# Altium project SL1 Xilinx Spartan-IIE PQ208 Rev1.01.PrjPcb
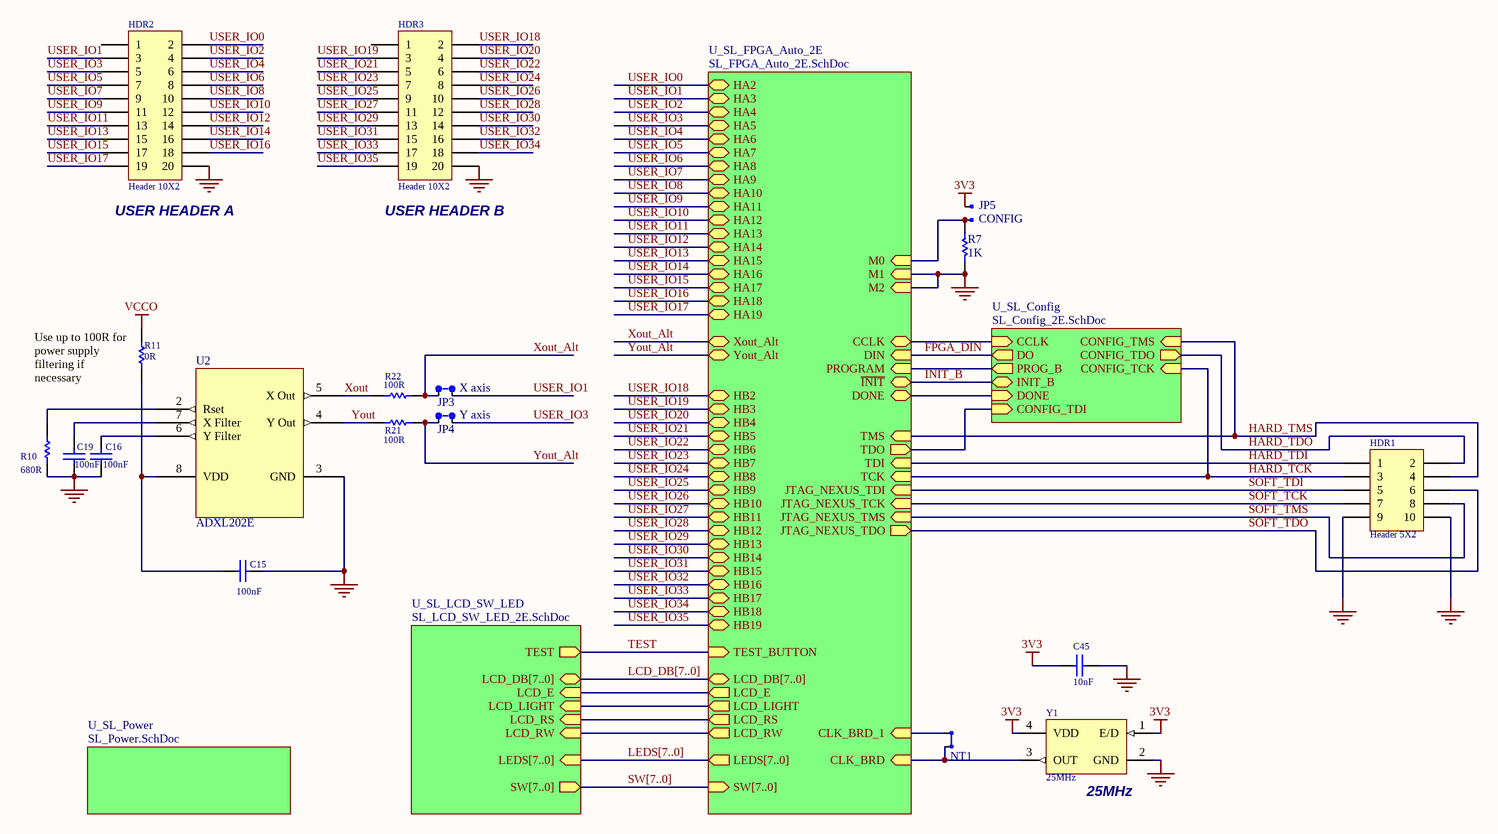
[diagram p0: SL1 Xilinx Spartan-IIE PQ208 Rev1.01.SchDoc]
5 sheets, 117 parts. Net scope: hierarchical (ports join the sheet entries above them; power ports are global).
Board file: SL1 Xilinx Spartan-IIE PQ208 Rev1.01.PcbDoc
Sheets:
  SL1 Xilinx Spartan-IIE PQ208 Rev1.01.SchDoc
    U_SL_Config = SL_Config_2E.SchDoc
    U_SL_LCD_SW_LED = SL_LCD_SW_LED_2E.SchDoc
    U_SL_FPGA_Auto_2E = SL_FPGA_Auto_2E.SchDoc
    U_SL_Power = SL_Power.SchDoc

## Sheet SL1 Xilinx Spartan-IIE PQ208 Rev1.01.SchDoc: Spirit Level - Spartan 2E
size B; Organization: Altium Limited; Address1: L3, 12a Rodborough Rd; Address2: Frenchs Forest; Address3: NSW; Address4: Australia 2086; DocumentNumber: 5; SheetNumber: 5; SheetTotal: 5; Library Name: SpiritLevel_2E.SchLib

### Parts
C15  100nF  [CC1608-0603]
C16  100nF  [CC1608-0603]
C19  100nF  [CC1608-0603]
C45  10nF  [CC1608-0603]
HDR1  Header 5X2  [HDR2X5_LP]
HDR2  Header 10X2  [HDR2X10]
HDR3  Header 10X2  [HDR2X10]
JP3  X axis  [HDR1X2]
JP4  Y axis  [HDR1X2]
JP5  CONFIG  [HDR1X2]
JS2  Short Linking  (value not drawn)  (mechanical)
JS3  Shorting Link  (value not drawn)  (mechanical)
NT1  GND  [NT]  (value not drawn)  (net tie, no BOM)
R7  1K  [CR2012-0805]
R10  680R  [CR2012-0805]
R11  0R  [CR2012-0805]
R21  100R  [CR2012-0805]
R22  100R  [CR2012-0805]
U2  ADXL202E  [E-8]
Y1  25MHz  [QSMO_4200]

### Sub-sheets
U_SL_Config = SL_Config_2E.SchDoc: PROG_B (out), CONFIG_TDO (out), DO (out), CCLK (in), CONFIG_TDI (in), CONFIG_TCK (in), CONFIG_TMS (in), INIT_B (bidir), DONE (in)
U_SL_FPGA_Auto_2E = SL_FPGA_Auto_2E.SchDoc: CLK_BRD (in), HA10 (bidir), HA11 (bidir), HA12 (bidir), HA13 (bidir), HA14 (bidir), HA15 (bidir), HA16 (bidir), HA17 (bidir), HA18 (bidir), HA19 (bidir), HA2 (bidir), HA3 (bidir), HA4 (bidir), HA5 (bidir), HA6 (bidir), HA7 (bidir), HA8 (bidir), HA9 (bidir), HB10 (bidir), HB11 (bidir), HB12 (bidir), HB13 (bidir), HB14 (bidir), HB15 (bidir), HB16 (bidir), HB17 (bidir), HB18 (bidir), HB19 (bidir), HB2 (bidir), HB3 (bidir), HB4 (bidir), HB5 (bidir), HB6 (bidir), HB7 (bidir), HB8 (bidir), HB9 (bidir), JTAG_NEXUS_TCK (in), JTAG_NEXUS_TDI (in), JTAG_NEXUS_TDO (out), JTAG_NEXUS_TMS (in), LCD_DB[7..0] (bidir), LCD_E (out), LCD_LIGHT (out), LCD_RS (out), LCD_RW (out), LEDS[7..0] (out), SW[7..0] (in), TEST_BUTTON (in), CCLK (bidir), DONE (bidir), M0 (in), M1 (in), M2 (in), PROGRAM (in), TCK (in), TDI (in), TDO (out), TMS (in), DIN (in), ~{INIT} (bidir), CLK_BRD_1 (in), Xout_Alt, Yout_Alt
U_SL_LCD_SW_LED = SL_LCD_SW_LED_2E.SchDoc: TEST (out), SW[7..0] (out), LCD_DB[7..0] (bidir), LCD_E (in), LCD_RS (in), LCD_RW (in), LCD_LIGHT (in), LEDS[7..0] (in)
U_SL_Power = SL_Power.SchDoc: no entries

### Nets
GND: C15.2 C16.2 C19.2 C45.2 HDR1.9 HDR1.10 HDR2.20 HDR3.20 R7.1 R10.1 U2.3(GND) Y1.2(GND) ; sheet U_SL_FPGA_Auto_2E/M1, sheet U_SL_FPGA_Auto_2E/M2
VCCO: C45.1 JP5.2 R11.1 Y1.1(E/D) Y1.4(VDD)  [also labelled 3V3]
CCLK: sheet U_SL_Config/CCLK, sheet U_SL_FPGA_Auto_2E/CCLK
CLK_BRD: NT1.2 Y1.3(OUT) ; sheet U_SL_FPGA_Auto_2E/CLK_BRD
CLK_BRD_1: NT1.1 ; sheet U_SL_FPGA_Auto_2E/CLK_BRD_1
DONE: sheet U_SL_Config/DONE, sheet U_SL_FPGA_Auto_2E/DONE
FPGA_DIN: sheet U_SL_Config/DO, sheet U_SL_FPGA_Auto_2E/DIN  [project net DIN]
HARD_TCK: HDR1.3 ; sheet U_SL_Config/CONFIG_TCK, sheet U_SL_FPGA_Auto_2E/TCK
HARD_TDI: HDR1.1 ; sheet U_SL_FPGA_Auto_2E/TDI
HARD_TDO: HDR1.2 ; sheet U_SL_Config/CONFIG_TDO
HARD_TMS: HDR1.4 ; sheet U_SL_Config/CONFIG_TMS, sheet U_SL_FPGA_Auto_2E/TMS
INIT_B: sheet U_SL_Config/INIT_B, sheet U_SL_FPGA_Auto_2E/~{INIT}  [project net ~{INIT}]
LCD_E: sheet U_SL_LCD_SW_LED/LCD_E, sheet U_SL_FPGA_Auto_2E/LCD_E
LCD_LIGHT: sheet U_SL_LCD_SW_LED/LCD_LIGHT, sheet U_SL_FPGA_Auto_2E/LCD_LIGHT
LCD_RS: sheet U_SL_LCD_SW_LED/LCD_RS, sheet U_SL_FPGA_Auto_2E/LCD_RS
LCD_RW: sheet U_SL_LCD_SW_LED/LCD_RW, sheet U_SL_FPGA_Auto_2E/LCD_RW
M0: JP5.1 R7.2 ; sheet U_SL_FPGA_Auto_2E/M0
PROG_B: sheet U_SL_Config/PROG_B, sheet U_SL_FPGA_Auto_2E/PROGRAM
SOFT_TCK: HDR1.7 ; sheet U_SL_FPGA_Auto_2E/JTAG_NEXUS_TCK  [project net JTAG_NEXUS_TCK]
SOFT_TDI: HDR1.5 ; sheet U_SL_FPGA_Auto_2E/JTAG_NEXUS_TDI  [project net JTAG_NEXUS_TDI]
SOFT_TDO: HDR1.6 ; sheet U_SL_FPGA_Auto_2E/JTAG_NEXUS_TDO  [project net JTAG_NEXUS_TDO]
SOFT_TMS: HDR1.8 ; sheet U_SL_FPGA_Auto_2E/JTAG_NEXUS_TMS  [project net JTAG_NEXUS_TMS]
TDI_C: sheet U_SL_Config/CONFIG_TDI, sheet U_SL_FPGA_Auto_2E/TDO
TEST: sheet U_SL_LCD_SW_LED/TEST, sheet U_SL_FPGA_Auto_2E/TEST_BUTTON
USER_IO0: HDR2.2 ; sheet U_SL_FPGA_Auto_2E/HA2  [project net HA2]
USER_IO1: HDR2.3 JP3.2 ; sheet U_SL_FPGA_Auto_2E/HA3  [project net HA3]
USER_IO2: HDR2.4 ; sheet U_SL_FPGA_Auto_2E/HA4  [project net HA4]
USER_IO3: HDR2.5 JP4.2 ; sheet U_SL_FPGA_Auto_2E/HA5  [project net HA5]
USER_IO4: HDR2.6 ; sheet U_SL_FPGA_Auto_2E/HA6  [project net HA6]
USER_IO5: HDR2.7 ; sheet U_SL_FPGA_Auto_2E/HA7  [project net HA7]
USER_IO6: HDR2.8 ; sheet U_SL_FPGA_Auto_2E/HA8  [project net HA8]
USER_IO7: HDR2.9 ; sheet U_SL_FPGA_Auto_2E/HA9  [project net HA9]
USER_IO8: HDR2.10 ; sheet U_SL_FPGA_Auto_2E/HA10  [project net HA10]
USER_IO9: HDR2.11 ; sheet U_SL_FPGA_Auto_2E/HA11  [project net HA11]
USER_IO10: HDR2.12 ; sheet U_SL_FPGA_Auto_2E/HA12  [project net HA12]
USER_IO11: HDR2.13 ; sheet U_SL_FPGA_Auto_2E/HA13  [project net HA13]
USER_IO12: HDR2.14 ; sheet U_SL_FPGA_Auto_2E/HA14  [project net HA14]
USER_IO13: HDR2.15 ; sheet U_SL_FPGA_Auto_2E/HA15  [project net HA15]
USER_IO14: HDR2.16 ; sheet U_SL_FPGA_Auto_2E/HA16  [project net HA16]
USER_IO15: HDR2.17 ; sheet U_SL_FPGA_Auto_2E/HA17  [project net HA17]
USER_IO16: HDR2.18 ; sheet U_SL_FPGA_Auto_2E/HA18  [project net HA18]
USER_IO17: HDR2.19 ; sheet U_SL_FPGA_Auto_2E/HA19  [project net HA19]
USER_IO18: HDR3.2 ; sheet U_SL_FPGA_Auto_2E/HB2  [project net HB2]
USER_IO19: HDR3.3 ; sheet U_SL_FPGA_Auto_2E/HB3  [project net HB3]
USER_IO20: HDR3.4 ; sheet U_SL_FPGA_Auto_2E/HB4  [project net HB4]
USER_IO21: HDR3.5 ; sheet U_SL_FPGA_Auto_2E/HB5  [project net HB5]
USER_IO22: HDR3.6 ; sheet U_SL_FPGA_Auto_2E/HB6  [project net HB6]
USER_IO23: HDR3.7 ; sheet U_SL_FPGA_Auto_2E/HB7  [project net HB7]
USER_IO24: HDR3.8 ; sheet U_SL_FPGA_Auto_2E/HB8  [project net HB8]
USER_IO25: HDR3.9 ; sheet U_SL_FPGA_Auto_2E/HB9  [project net HB9]
USER_IO26: HDR3.10 ; sheet U_SL_FPGA_Auto_2E/HB10  [project net HB10]
USER_IO27: HDR3.11 ; sheet U_SL_FPGA_Auto_2E/HB11  [project net HB11]
USER_IO28: HDR3.12 ; sheet U_SL_FPGA_Auto_2E/HB12  [project net HB12]
USER_IO29: HDR3.13 ; sheet U_SL_FPGA_Auto_2E/HB13  [project net HB13]
USER_IO30: HDR3.14 ; sheet U_SL_FPGA_Auto_2E/HB14  [project net HB14]
USER_IO31: HDR3.15 ; sheet U_SL_FPGA_Auto_2E/HB15  [project net HB15]
USER_IO32: HDR3.16 ; sheet U_SL_FPGA_Auto_2E/HB16  [project net HB16]
USER_IO33: HDR3.17 ; sheet U_SL_FPGA_Auto_2E/HB17  [project net HB17]
USER_IO34: HDR3.18 ; sheet U_SL_FPGA_Auto_2E/HB18  [project net HB18]
USER_IO35: HDR3.19 ; sheet U_SL_FPGA_Auto_2E/HB19  [project net HB19]
Xout: R22.2 U2.5(X_Out)
Xout_Alt: JP3.1 R22.1 ; sheet U_SL_FPGA_Auto_2E/Xout_Alt
Yout: R21.2 U2.4(Y_Out)
Yout_Alt: JP4.1 R21.1 ; sheet U_SL_FPGA_Auto_2E/Yout_Alt
NetC15_1: C15.1 R11.2 U2.8(VDD)
NetC16_1: C16.1 U2.6(Y_Filter)
NetC19_1: C19.1 U2.7(X_Filter)
NetR10_2: R10.2 U2.2(Rset)

Not connected (* = marked no-connect by the designer): HDR2 1; HDR3 1; U2 1(Self_Test)

### Buses and harness runs
bus LCD_DB[7..0] = sheet U_SL_FPGA_Auto_2E/LCD_DB[7..0] = sheet U_SL_LCD_SW_LED/LCD_DB[7..0]
bus LEDS[7..0] = sheet U_SL_FPGA_Auto_2E/LEDS[7..0] = sheet U_SL_LCD_SW_LED/LEDS[7..0]
bus SW[7..0] = sheet U_SL_FPGA_Auto_2E/SW[7..0] = sheet U_SL_LCD_SW_LED/SW[7..0]

### Notes on the sheet
- (near HDR2) USER HEADER A
- (near HDR3) USER HEADER B
- (near R11) Use up to 100R for power supply filtering if necessary
- (near Y1) 25MHz
- Title
- Size:
- Date:
- B
- Number:
- Time:
- Revision:
- Sheet
- of
- File:

### Library data of the parts
C15 C16 C19 = CAP: Capacitor; AEMS Code: 2101550
C45 = CAP: Capacitor; AEMS Code: 2100341
HDR1 = Header 5X2: Header, 5-Pin, Dual row; Revision: 17-Jul-2002: Re-released for DXP Platform.
HDR2 HDR3 = Header 10X2: Header, 10-Pin, Dual row; Revision: July-2002: Re-released for DXP Platform.
JP3-JP5 = Jumper, 2-Pin
JS2 JS3 = Jumper Socket: Shorting Link, 2.54mm (0.1") Pitch
NT1 = Jumper, 2-Pin_1: Jumper, 2-Pin
R7 = RES: Resistor; AEMS Code: 1200008JN
R10 = Res1: Resistor; AEMS Code: CHANGED VALUE; Revision: July-2002: Re-released for DXP Platform.
R11 = RES: Resistor; AEMS Code: 1200075
R21 R22 = Res1: Resistor; AEMS Code: 1200012JT; Revision: July-2002: Re-released for DXP Platform.
U2 = ADXL202E: Accelerometer with Digital Output
Y1 = QSMO_4200: Surface Mount Crystal Oscillator

## Sheet SL_Config_2E.SchDoc: FPGA Configuration
size A; Organization: Altium Limited; Address1: L3, 12a Rodborough Rd; Address2: Frenchs Forest; Address3: NSW; Address4: Australia 2086; DocumentNumber: 2; SheetNumber: 2; SheetTotal: 5; Library Name: SpiritLevel_2E.SchLib
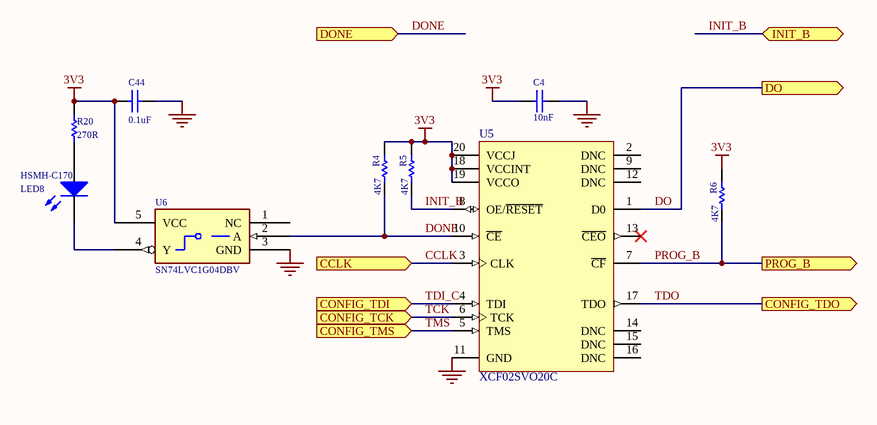
[diagram p1: SL_Config_2E.SchDoc]

### Parts
C4  10nF  [CC1608-0603]
C44  0.1uF  [CC2012-0805]
LED8  HSMH-C170  [SMD _LED]
R4  4K7  [CR2012-0805]
R5  4K7  [CR2012-0805]
R6  4K7  [CR2012-0805]
R20  270R  [CR2012-0805]
U5  XCF02SVO20C  [VO20]
U6  SN74LVC1G04DBV  [SO-G5/P.95]

### Ports
CCLK (in), CONFIG_TCK (in), CONFIG_TDI (in), CONFIG_TDO (out), CONFIG_TMS (in), DO (out), DONE (in), INIT_B (bidir), PROG_B (out)

### Nets
3V3: C4.1 C44.2 R4.1 R5.1 R6.1 R20.2 U5.18(VCCINT) U5.19(VCCO) U5.20(VCCJ) U6.5(VCC)  [project net VCCO]
GND: C4.2 C44.1 U5.11(GND) U6.3(GND)
CCLK: U5.3(CLK) ; port CCLK
DO: U5.1(D0) ; port DO  [project net DIN]
DONE: R4.2 U5.10(~{CE}) U6.2(A) ; port DONE
INIT_B: R5.2 U5.8(OE/~{RESET}) ; port INIT_B  [project net ~{INIT}]
PROG_B: R6.2 U5.7(~{CF}) ; port PROG_B
TCK: U5.6(TCK) ; port CONFIG_TCK  [project net HARD_TCK]
TDI_C: U5.4(TDI) ; port CONFIG_TDI
TDO: U5.17(TDO) ; port CONFIG_TDO  [project net HARD_TDO]
TMS: U5.5(TMS) ; port CONFIG_TMS  [project net HARD_TMS]
NetLED8_1: LED8.1(A) R20.1
NetLED8_2: LED8.2(K) U6.4(Y)

Not connected (* = marked no-connect by the designer): U5 2(DNC) 9(DNC) 12(DNC) 13(~{CEO})* 14(DNC) 15(DNC) 16(DNC); U6 1(NC)

### Notes on the sheet
- Title
- Size:
- Date:
- A
- Number:
- Time:
- Revision:
- Sheet
- of
- File:

### Library data of the parts
C4 = CAP: Capacitor; AEMS Code: 2100341
C44 = CAP: Capacitor; Supplier: FARNELL; Supplier Code: 317-287
LED8 = HSMX-C670: Typical RED GaAs SMD LED Agilent make; AEMS Code: 2610081; Revision: July-2002: Re-released for DXP Platform.
R4-R6 = RES: Resistor; AEMS Code: 1200226
R20 = RES: Resistor; AEMS Code: 1200430
U5 = XCF02SVO20C: XCF00S Series, Platform Flash In-System Programmable Configuration 3.3V PROM, 20-Pin TSOP, 2-Megabit, Commercial Grade; PackageDocument: ver1.0, May-2003; AEMS Code: CHANGED VALUE; DatasheetDocument: ver2.3, May-2004; PackageReference: VO20; Code_JEDEC: MO-153-AC
U6 = SN74AHC1G04DBVR: Manufacturer: TI

## Sheet SL_LCD_SW_LED_2E.SchDoc: LCD, Switches and LEDs
size B; Organization: Altium Limited; Address1: L3, 12a Rodborough Rd; Address2: Frenchs Forest; Address3: NSW; Address4: Australia 2086; DocumentNumber: 3; SheetNumber: 3; SheetTotal: 5; Library Name: SpiritLevel_2E.SchLib
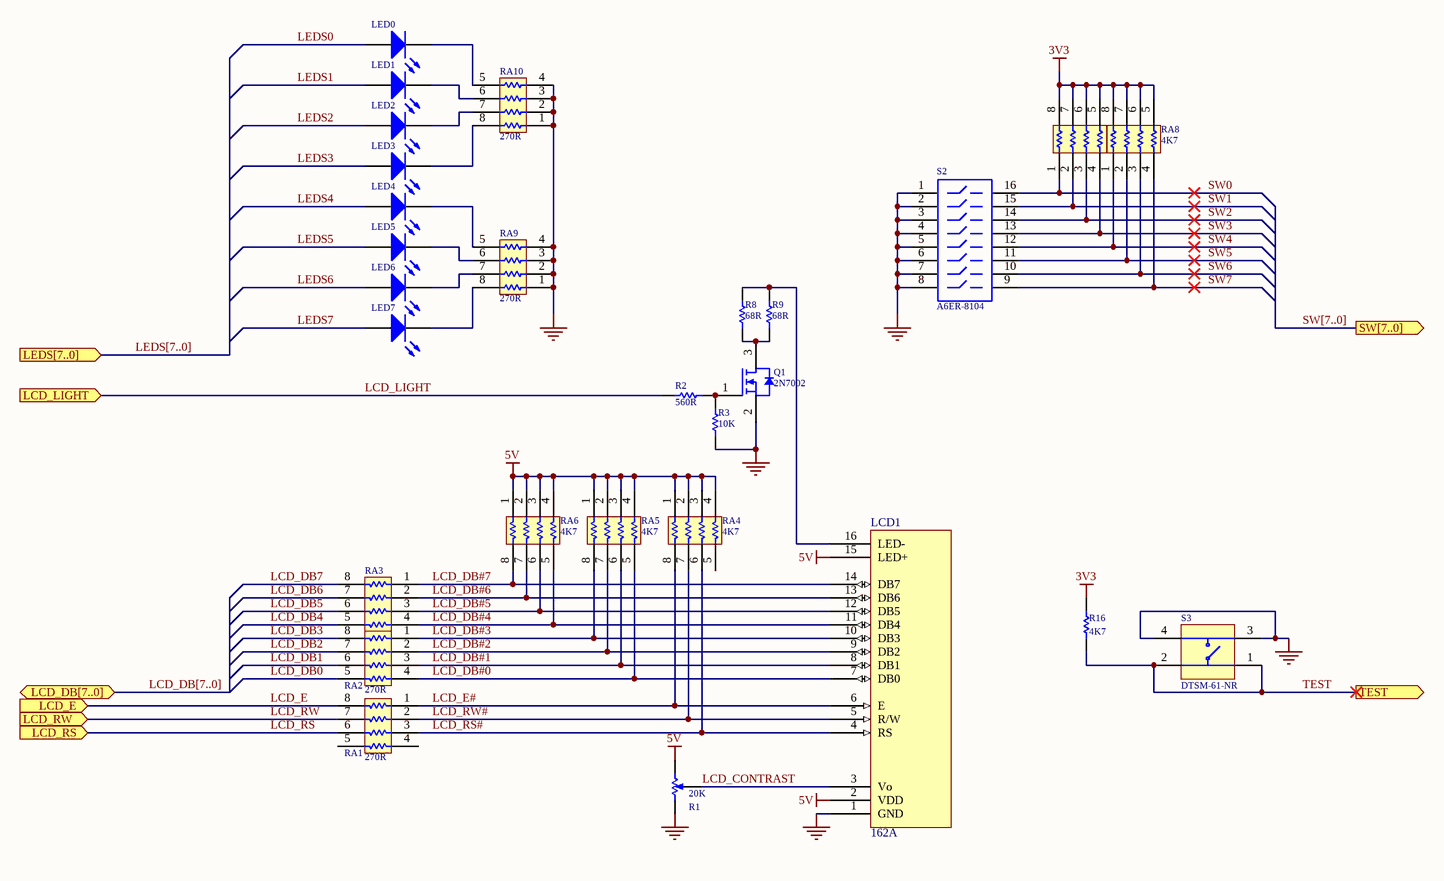
[diagram p2: SL_LCD_SW_LED_2E.SchDoc]

### Parts
LCD1  162A  [162A]
LED0  HSMH-C170  [SMD _LED]  (value not drawn)
LED1  HSMH-C170  [SMD _LED]  (value not drawn)
LED2  HSMH-C170  [SMD _LED]  (value not drawn)
LED3  HSMH-C170  [SMD _LED]  (value not drawn)
LED4  HSMH-C170  [SMD _LED]  (value not drawn)
LED5  HSMH-C170  [SMD _LED]  (value not drawn)
LED6  HSMH-C170  [SMD _LED]  (value not drawn)
LED7  HSMH-C170  [SMD _LED]  (value not drawn)
Q1  2N7002  [SO-G3]
R1  20K  [POT4MM-2]
R2  560R  [CC2012-0805]
R3  10K  [CC2012-0805]
R8  68R  [CC2012-0805]
R9  68R  [CC2012-0805]
R16  4K7  [CC2012-0805]
RA1  270R  [MNR34]
RA2  270R  [MNR34]
RA3  270R  [MNR34]
RA4  4K7  [MNR34T]
RA5  4K7  [MNR34T]
RA6  4K7  [MNR34T]
RA7  4K7  [MNR34T]
RA8  4K7  [MNR34T]
RA9  270R  [MNR34T]
RA10  270R  [MNR34T]
S2  A6ER-8104  [DIP-16-KEY]
S3  DTSM-61-NR  [B3FS_SWITCH]

### Ports
LCD_DB[7..0] (bidir), LCD_E (in), LCD_LIGHT (in), LCD_RS (in), LCD_RW (in), LEDS[7..0] (in), SW[7..0] (out), TEST (out)

### Nets
3V3: R16.1 RA7.5 RA7.6 RA7.7 RA7.8 RA8.5 RA8.6 RA8.7 RA8.8  [project net VCCO]
5V: LCD1.2(VDD) LCD1.15(LED+) R1.CW(+) RA4.1 RA4.2 RA4.3 RA4.4 RA5.1 RA5.2 RA5.3 RA5.4 RA6.1 RA6.2 RA6.3 RA6.4
GND: LCD1.1(GND) Q1.2 R1.CCW(-) R3.1 RA9.1 RA9.2 RA9.3 RA9.4 RA10.1 RA10.2 RA10.3 RA10.4 S2.1 S2.2 S2.3 S2.4 S2.5 S2.6 S2.7 S2.8 S3.3 S3.4
LCD_CONTRAST: LCD1.3(Vo) R1.W
LCD_DB0: RA2.5
LCD_DB1: RA2.6
LCD_DB2: RA2.7
LCD_DB3: RA2.8
LCD_DB4: RA3.5
LCD_DB5: RA3.6
LCD_DB6: RA3.7
LCD_DB7: RA3.8
LCD_DB#0: LCD1.7(DB0) RA2.4 RA5.5
LCD_DB#1: LCD1.8(DB1) RA2.3 RA5.6
LCD_DB#2: LCD1.9(DB2) RA2.2 RA5.7
LCD_DB#3: LCD1.10(DB3) RA2.1 RA5.8
LCD_DB#4: LCD1.11(DB4) RA3.4 RA6.5
LCD_DB#5: LCD1.12(DB5) RA3.3 RA6.6
LCD_DB#6: LCD1.13(DB6) RA3.2 RA6.7
LCD_DB#7: LCD1.14(DB7) RA3.1 RA6.8
LCD_E: RA1.8 ; port LCD_E
LCD_E#: LCD1.6(E) RA1.1 RA4.8
LCD_LIGHT: R2.1 ; port LCD_LIGHT
LCD_RS: RA1.6 ; port LCD_RS
LCD_RS#: LCD1.4(RS) RA1.3 RA4.6
LCD_RW: RA1.7 ; port LCD_RW
LCD_RW#: LCD1.5(R/W) RA1.2 RA4.7
LEDS0: LED0.1(A)
LEDS1: LED1.1(A)
LEDS2: LED2.1(A)
LEDS3: LED3.1(A)
LEDS4: LED4.1(A)
LEDS5: LED5.1(A)
LEDS6: LED6.1(A)
LEDS7: LED7.1(A)
SW0: RA7.1 S2.16
SW1: RA7.2 S2.15
SW2: RA7.3 S2.14
SW3: RA7.4 S2.13
SW4: RA8.1 S2.12
SW5: RA8.2 S2.11
SW6: RA8.3 S2.10
SW7: RA8.4 S2.9
TEST: R16.2 S3.1 S3.2 ; port TEST
NetLCD1_16: LCD1.16(LED-) R8.1 R9.1
NetLED0_2: LED0.2(K) RA10.5
NetLED1_2: LED1.2(K) RA10.6
NetLED2_2: LED2.2(K) RA10.7
NetLED3_2: LED3.2(K) RA10.8
NetLED4_2: LED4.2(K) RA9.5
NetLED5_2: LED5.2(K) RA9.6
NetLED6_2: LED6.2(K) RA9.7
NetLED7_2: LED7.2(K) RA9.8
NetQ1_1: Q1.1 R2.2 R3.2
NetQ1_3: Q1.3 R8.2 R9.2

Not connected (* = marked no-connect by the designer): RA1 4 5; RA4 5

### Buses and harness runs
bus LCD_DB[7..0] = port LCD_DB[7..0]
bus LEDS[7..0] = port LEDS[7..0]
bus SW[7..0] = port SW[7..0]

### Notes on the sheet
- Title
- Size:
- Date:
- B
- Number:
- Time:
- Revision:
- Sheet
- of
- File:

### Library data of the parts
LCD1 = 162A: 16 char * 2 line LCD character display with b/light
LED0-LED7 = HSMX-C670: as LED8 on sheet SL_Config_2E; Revision: July-2002: Re-released for DXP Platform.
Q1 = 2N7002: N Channel Mosfet
R1 = RPot SM: Square Trimming Potentiometer; AEMS Code: 1400226
R2 = RES: Resistor; AEMS Code: 1200723
R3 = RES: Resistor; AEMS Code: 1200006JT
R8 R9 = RES: Resistor; AEMS Code: 1200821
R16 = RES: Resistor; AEMS Code: 1200226
RA1-RA3 RA9 RA10 = MNR34: 3216x4 Resistor Array; AEMS Code: 1310010
RA4-RA8 = MNR34: 3216x4 Resistor Array; AEMS Code: 1300330
S2 = A6ER-8104: DIP Switch Side actuator long liver Piano Key; Revision: July-2002: Re-released for DXP Platform.
S3 = B3FS: SPNA SMD Keyboard Switch

## Sheet SL_FPGA_Auto_2E.SchDoc
size C; Generated From FPGA Project: SpiritLevel.PRJFPG; UNUSED_SPECIAL: RouteSeparate; UNUSED_IO: Ignore; VREF: Ignore; UNUSED_INPUT: Ignore; DocumentNumber: 1; SheetNumber: 1; SheetTotal: 5; Library Name: SpiritLevel_2E.SchLib
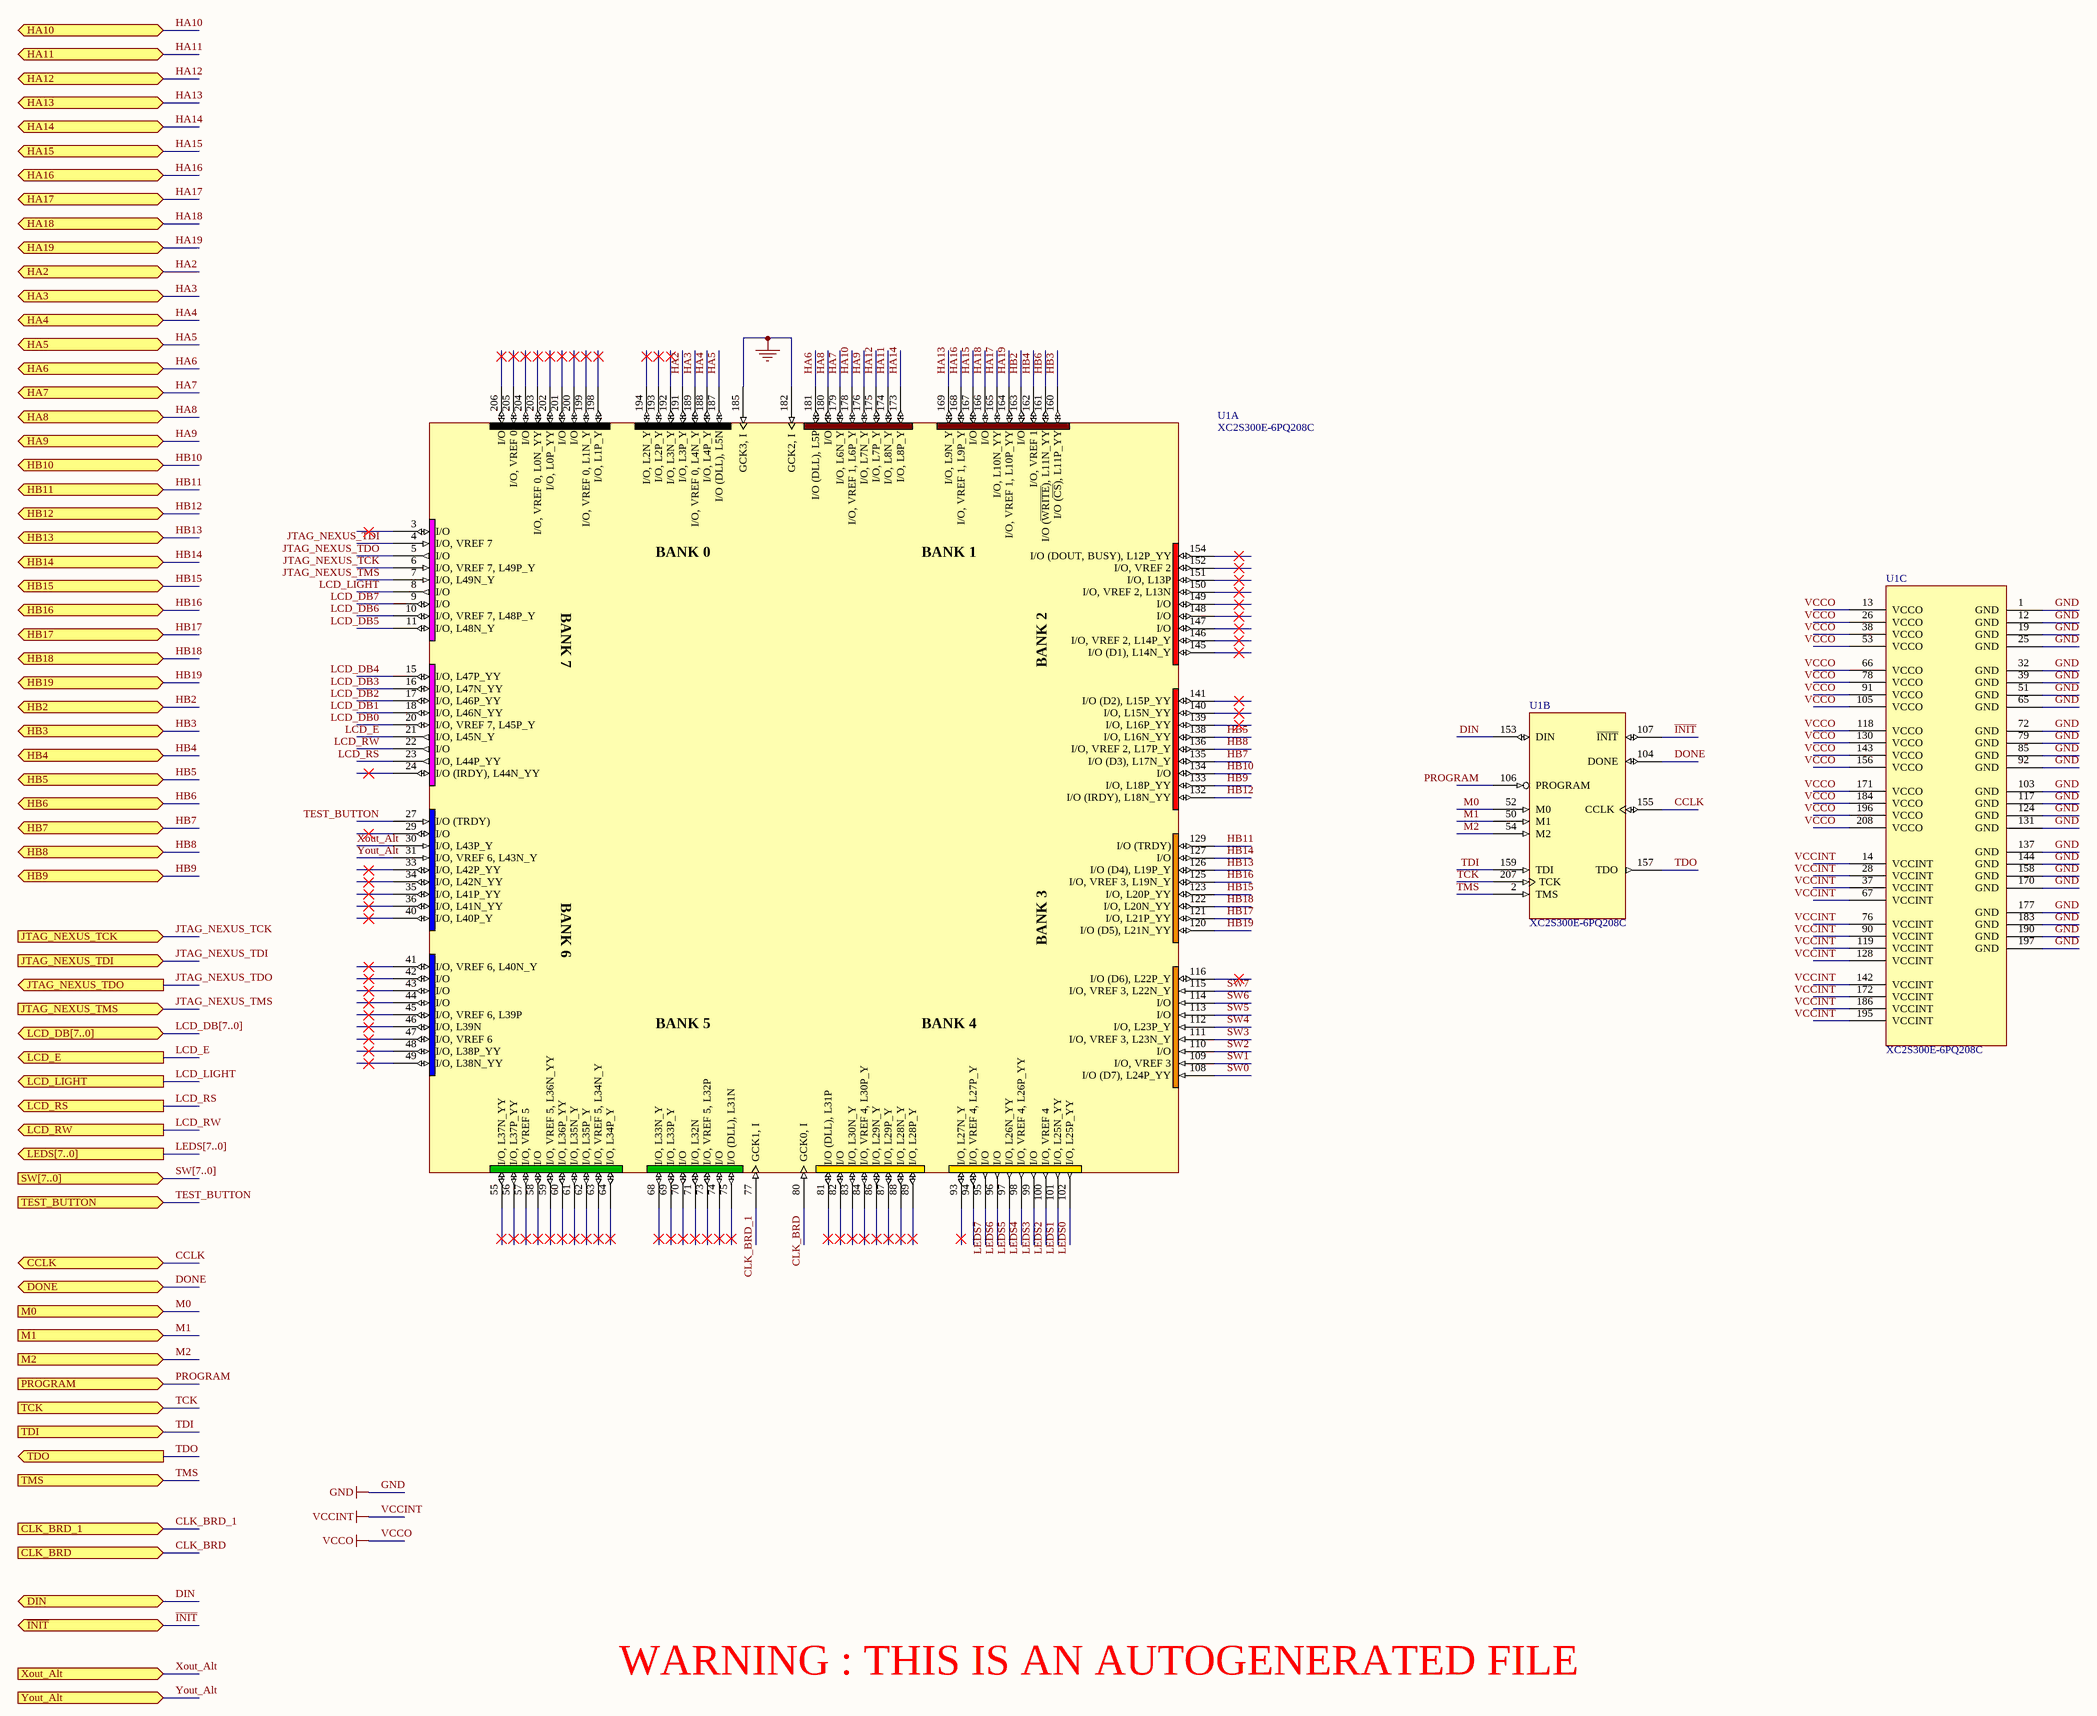
[diagram p3: SL_FPGA_Auto_2E.SchDoc]

### Parts
U1  XC2S300E-6PQ208C  [PQ208]  (parts A,B,C of 3)

### Ports
CCLK (bidir), CLK_BRD (in), CLK_BRD_1 (in), DIN (bidir), DONE (bidir), HA2 (bidir), HA3 (bidir), HA4 (bidir), HA5 (bidir), HA6 (bidir), HA7 (bidir), HA8 (bidir), HA9 (bidir), HA10 (bidir), HA11 (bidir), HA12 (bidir), HA13 (bidir), HA14 (bidir), HA15 (bidir), HA16 (bidir), HA17 (bidir), HA18 (bidir), HA19 (bidir), HB2 (bidir), HB3 (bidir), HB4 (bidir), HB5 (bidir), HB6 (bidir), HB7 (bidir), HB8 (bidir), HB9 (bidir), HB10 (bidir), HB11 (bidir), HB12 (bidir), HB13 (bidir), HB14 (bidir), HB15 (bidir), HB16 (bidir), HB17 (bidir), HB18 (bidir), HB19 (bidir), JTAG_NEXUS_TCK (in), JTAG_NEXUS_TDI (in), JTAG_NEXUS_TDO (out), JTAG_NEXUS_TMS (in), LCD_DB[7..0] (bidir), LCD_E (out), LCD_LIGHT (out), LCD_RS (out), LCD_RW (out), LEDS[7..0] (out), M0 (in), M1 (in), M2 (in), PROGRAM (in), SW[7..0] (in), TCK (in), TDI (in), TDO (out), TEST_BUTTON (in), TMS (in), Xout_Alt (in), Yout_Alt (in), ~{INIT} (bidir)

### Nets
GND: U1.1(GND) U1.12(GND) U1.19(GND) U1.25(GND) U1.32(GND) U1.39(GND) U1.50(M1) U1.51(GND) U1.54(M2) U1.65(GND) U1.72(GND) U1.79(GND) U1.85(GND) U1.92(GND) U1.103(GND) U1.117(GND) U1.124(GND) U1.131(GND) U1.137(GND) U1.144(GND) U1.158(GND) U1.170(GND) U1.177(GND) U1.182(GCK2,_I) U1.183(GND) U1.185(GCK3,_I) U1.190(GND) U1.197(GND) ; port M1, port M2  [also labelled M1, M2]
VCCINT: U1.14(VCCINT) U1.28(VCCINT) U1.37(VCCINT) U1.67(VCCINT) U1.76(VCCINT) U1.90(VCCINT) U1.119(VCCINT) U1.128(VCCINT) U1.142(VCCINT) U1.172(VCCINT) U1.186(VCCINT) U1.195(VCCINT)
VCCO: U1.13(VCCO) U1.26(VCCO) U1.38(VCCO) U1.53(VCCO) U1.66(VCCO) U1.78(VCCO) U1.91(VCCO) U1.105(VCCO) U1.118(VCCO) U1.130(VCCO) U1.143(VCCO) U1.156(VCCO) U1.171(VCCO) U1.184(VCCO) U1.196(VCCO) U1.208(VCCO)
CCLK: U1.155(CCLK) ; port CCLK
CLK_BRD: U1.80(GCK0,_I) ; port CLK_BRD
CLK_BRD_1: U1.77(GCK1,_I) ; port CLK_BRD_1
DIN: U1.153(DIN) ; port DIN
DONE: U1.104(DONE) ; port DONE
HA2: U1.191(I/O,_L3P_Y) ; port HA2
HA3: U1.189(I/O,_VREF_0,_L4N_Y) ; port HA3
HA4: U1.188(I/O,_L4P_Y) ; port HA4
HA5: U1.187(I/O_(DLL),_L5N) ; port HA5
HA6: U1.181(I/O_(DLL),_L5P) ; port HA6
HA7: U1.179(I/O,_L6N_Y) ; port HA7
HA8: U1.180(I/O) ; port HA8
HA9: U1.176(I/O,_L7N_Y) ; port HA9
HA10: U1.178(I/O,_VREF_1,_L6P_Y) ; port HA10
HA11: U1.174(I/O,_L8N_Y) ; port HA11
HA12: U1.175(I/O,_L7P_Y) ; port HA12
HA13: U1.169(I/O,_L9N_Y) ; port HA13
HA14: U1.173(I/O,_L8P_Y) ; port HA14
HA15: U1.167(I/O) ; port HA15
HA16: U1.168(I/O,_VREF_1,_L9P_Y) ; port HA16
HA17: U1.165(I/O,_L10N_YY) ; port HA17
HA18: U1.166(I/O) ; port HA18
HA19: U1.164(I/O,_VREF_1,_L10P_YY) ; port HA19
HB2: U1.163(I/O) ; port HB2
HB3: U1.160(I/O_(~{CS}),_L11P_YY) ; port HB3
HB4: U1.162(I/O,_VREF_1) ; port HB4
HB5: U1.138(I/O,_L16N_YY) ; port HB5
HB6: U1.161(I/O_(~{WRITE}),_L11N_YY) ; port HB6
HB7: U1.135(I/O_(D3),_L17N_Y) ; port HB7
HB8: U1.136(I/O,_VREF_2,_L17P_Y) ; port HB8
HB9: U1.133(I/O,_L18P_YY) ; port HB9
HB10: U1.134(I/O) ; port HB10
HB11: U1.129(I/O_(TRDY)) ; port HB11
HB12: U1.132(I/O_(IRDY),_L18N_YY) ; port HB12
HB13: U1.126(I/O_(D4),_L19P_Y) ; port HB13
HB14: U1.127(I/O) ; port HB14
HB15: U1.123(I/O,_L20P_YY) ; port HB15
HB16: U1.125(I/O,_VREF_3,_L19N_Y) ; port HB16
HB17: U1.121(I/O,_L21P_YY) ; port HB17
HB18: U1.122(I/O,_L20N_YY) ; port HB18
HB19: U1.120(I/O_(D5),_L21N_YY) ; port HB19
~{INIT}: U1.107(~{INIT}) ; port ~{INIT}
JTAG_NEXUS_TCK: U1.6(I/O,_VREF_7,_L49P_Y) ; port JTAG_NEXUS_TCK
JTAG_NEXUS_TDI: U1.4(I/O,_VREF_7) ; port JTAG_NEXUS_TDI
JTAG_NEXUS_TDO: U1.5(I/O) ; port JTAG_NEXUS_TDO
JTAG_NEXUS_TMS: U1.7(I/O,_L49N_Y) ; port JTAG_NEXUS_TMS
LCD_DB0: U1.20(I/O,_VREF_7,_L45P_Y)
LCD_DB1: U1.18(I/O,_L46N_YY)
LCD_DB2: U1.17(I/O,_L46P_YY)
LCD_DB3: U1.16(I/O,_L47N_YY)
LCD_DB4: U1.15(I/O,_L47P_YY)
LCD_DB5: U1.11(I/O,_L48N_Y)
LCD_DB6: U1.10(I/O,_VREF_7,_L48P_Y)
LCD_DB7: U1.9(I/O)
LCD_E: U1.21(I/O,_L45N_Y) ; port LCD_E
LCD_LIGHT: U1.8(I/O) ; port LCD_LIGHT
LCD_RS: U1.23(I/O,_L44P_YY) ; port LCD_RS
LCD_RW: U1.22(I/O) ; port LCD_RW
LEDS0: U1.102(I/O,_L25P_YY)
LEDS1: U1.101(I/O,_L25N_YY)
LEDS2: U1.100(I/O,_VREF_4)
LEDS3: U1.99(I/O)
LEDS4: U1.98(I/O,_VREF_4,_L26P_YY)
LEDS5: U1.97(I/O,_L26N_YY)
LEDS6: U1.96(I/O)
LEDS7: U1.95(I/O)
M0: U1.52(M0) ; port M0
PROGRAM: U1.106(PROGRAM) ; port PROGRAM  [project net PROG_B]
SW0: U1.108(I/O_(D7),_L24P_YY)
SW1: U1.109(I/O,_VREF_3)
SW2: U1.110(I/O)
SW3: U1.111(I/O,_VREF_3,_L23N_Y)
SW4: U1.112(I/O,_L23P_Y)
SW5: U1.113(I/O)
SW6: U1.114(I/O)
SW7: U1.115(I/O,_VREF_3,_L22N_Y)
TCK: U1.207(TCK) ; port TCK  [project net HARD_TCK]
TDI: U1.159(TDI) ; port TDI  [project net HARD_TDI]
TDO: U1.157(TDO) ; port TDO  [project net TDI_C]
TEST_BUTTON: U1.27(I/O_(TRDY)) ; port TEST_BUTTON  [project net TEST]
TMS: U1.2(TMS) ; port TMS  [project net HARD_TMS]
Xout_Alt: U1.30(I/O,_L43P_Y) ; port Xout_Alt
Yout_Alt: U1.31(I/O,_VREF_6,_L43N_Y) ; port Yout_Alt

Not connected (* = marked no-connect by the designer): U1 3(I/O)* 24(I/O_(IRDY),_L44N_YY)* 29(I/O)* 33(I/O,_L42P_YY)* 34(I/O,_L42N_YY)* 35(I/O,_L41P_YY)* 36(I/O,_L41N_YY)* 40(I/O,_L40P_Y)* 41(I/O,_VREF_6,_L40N_Y)* 42(I/O)* 43(I/O)* 44(I/O)* 45(I/O,_VREF_6,_L39P)* 46(I/O,_L39N)* 47(I/O,_VREF_6)* 48(I/O,_L38P_YY)* 49(I/O,_L38N_YY)* 55(I/O,_L37N_YY)* 56(I/O,_L37P_YY)* 57(I/O,_VREF_5)* 58(I/O)* 59(I/O,_VREF_5,_L36N_YY)* 60(I/O,_L36P_YY)* 61(I/O,_L35N_Y)* 62(I/O,_L35P_Y)* 63(I/O,_VREF_5,_L34N_Y)* 64(I/O,_L34P_Y)* 68(I/O,_L33N_Y)* 69(I/O,_L33P_Y)* 70(I/O)* 71(I/O,_L32N)* 73(I/O,_VREF_5,_L32P)* 74(I/O)* 75(I/O_(DLL),_L31N)* 81(I/O_(DLL),_L31P)* 82(I/O)* 83(I/O,_L30N_Y)* 84(I/O,_VREF_4,_L30P_Y)* 86(I/O,_L29N_Y)* 87(I/O,_L29P_Y)* 88(I/O,_L28N_Y)* 89(I/O,_L28P_Y)* 93(I/O,_L27N_Y)* 94(I/O,_VREF_4,_L27P_Y) 116(I/O_(D6),_L22P_Y)* 139(I/O,_L16P_YY)* 140(I/O,_L15N_YY)* 141(I/O_(D2),_L15P_YY)* 145(I/O_(D1),_L14N_Y)* 146(I/O,_VREF_2,_L14P_Y)* 147(I/O)* 148(I/O)* 149(I/O)* 150(I/O,_VREF_2,_L13N)* 151(I/O,_L13P)* 152(I/O,_VREF_2)* 154(I/O_(DOUT,_BUSY),_L12P_YY)* 192(I/O,_L3N_Y)* 193(I/O,_L2P_Y)* 194(I/O,_L2N_Y)* 198(I/O,_L1P_Y)* 199(I/O,_VREF_0,_L1N_Y)* 200(I/O)* 201(I/O)* 202(I/O,_L0P_YY)* 203(I/O,_VREF_0,_L0N_YY)* 204(I/O)* 205(I/O,_VREF_0)* 206(I/O)*

### Buses and harness runs
bus LCD_DB[7..0] = port LCD_DB[7..0]
bus LEDS[7..0] = port LEDS[7..0]
bus SW[7..0] = port SW[7..0]

### Notes on the sheet
- WARNING : THIS IS AN AUTOGENERATED FILE
- Title
- Size:
- Date:
- File:
- C
- Number:
- Time:
- Revision:
- Sheet
- of
- (in symbol XC2S300E-6PQ208C, part A) BANK 0; BANK 1; BANK 7; BANK 2; BANK 6; BANK 3; BANK 5; BANK 4

### Library data of the parts
U1 = XC2S300E-6PQ208C: Spartan-IIE 1.8V FPGA, 208-Pin PQFP, Standard Performance, Commercial Grade; Package Information: Latest Revision: ver1.1, Oct-2002; Code - JEDEC: MS-029-FA-1; Published: 19-Jul-2002; Revision: 17-Sep-2003: Pin names updated to match datasheet, ver2.1.; Datasheet: Latest Revision: 09-Jul-2003; Package Reference: PQ208; Publisher: Altium Limited

## Sheet SL_Power.SchDoc: Power Supply
size B; Organization: Altium Limited; Address1: L3, 12a Rodborough Rd; Address2: Frenchs Forest; Address3: NSW; Address4: Australia 2086; DocumentNumber: 4; SheetNumber: 4; SheetTotal: 5; Library Name: SpiritLevel_2E.SchLib
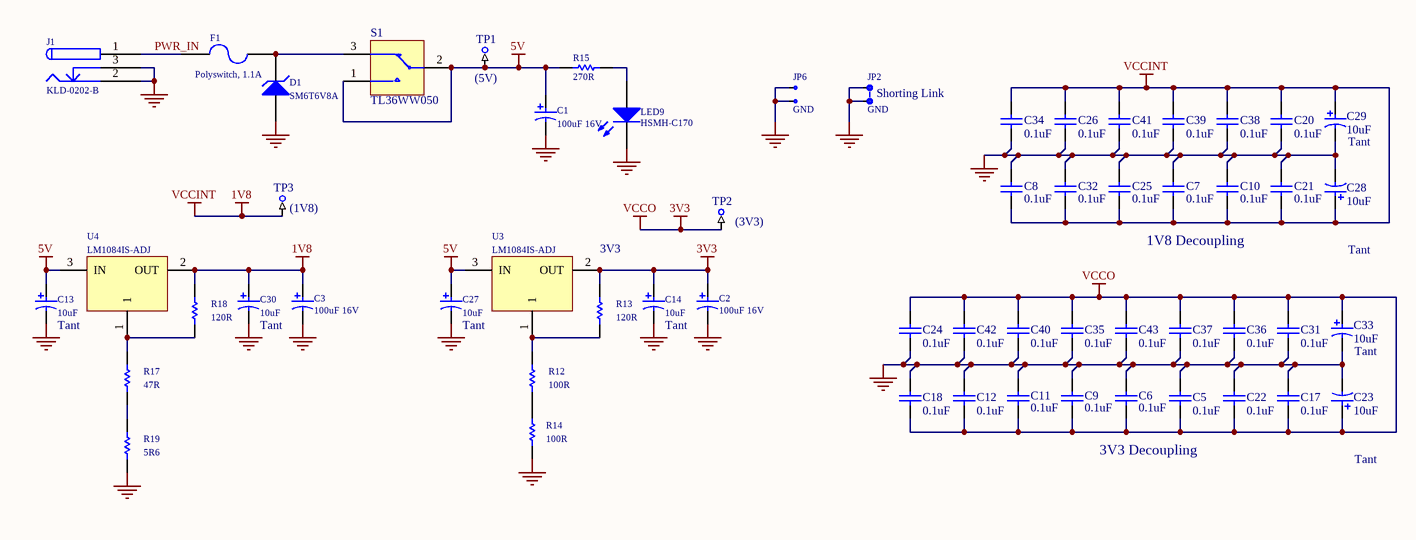
[diagram p4: SL_Power.SchDoc]

### Parts
C1  100uF 16V  [CAPPR2-5X6.8]
C2  100uF 16V  [CAPPR2-5X6.8]
C3  100uF 16V  [CAPPR2-5X6.8]
C5  0.1uF  [CC2012-0805]
C6  0.1uF  [CC2012-0805]
C7  0.1uF  [CC2012-0805]
C8  0.1uF  [CC2012-0805]
C9  0.1uF  [CC2012-0805]
C10  0.1uF  [CC2012-0805]
C11  0.1uF  [CC2012-0805]
C12  0.1uF  [CC2012-0805]
C13  10uF  Capacitor Type: Tant  [MCCT-B]
C14  10uF  Capacitor Type: Tant  [MCCT-B]
C17  0.1uF  [CC2012-0805]
C18  0.1uF  [CC2012-0805]
C20  0.1uF  [CC2012-0805]
C21  0.1uF  [CC2012-0805]
C22  0.1uF  [CC2012-0805]
C23  10uF  Capacitor Type: Tant  [MCCT-B]
C24  0.1uF  [CC2012-0805]
C25  0.1uF  [CC2012-0805]
C26  0.1uF  [CC2012-0805]
C27  10uF  Capacitor Type: Tant  [MCCT-B]
C28  10uF  Capacitor Type: Tant  [MCCT-B]
C29  10uF  Capacitor Type: Tant  [MCCT-B]
C30  10uF  Capacitor Type: Tant  [MCCT-B]
C31  0.1uF  [CC2012-0805]
C32  0.1uF  [CC2012-0805]
C33  10uF  Capacitor Type: Tant  [MCCT-B]
C34  0.1uF  [CC2012-0805]
C35  0.1uF  [CC2012-0805]
C36  0.1uF  [CC2012-0805]
C37  0.1uF  [CC2012-0805]
C38  0.1uF  [CC2012-0805]
C39  0.1uF  [CC2012-0805]
C40  0.1uF  [CC2012-0805]
C41  0.1uF  [CC2012-0805]
C42  0.1uF  [CC2012-0805]
C43  0.1uF  [CC2012-0805]
D1  SM6T6V8A  [DO214]
F1  Polyswitch, 1.1A  [RUE160_0.2]
J1  KLD-0202-B  [KLD-0202]
JP2  GND  [HDR1X2]
JP6  GND  [HDR1X2]
JS1  Shorting Link  (mechanical)
LED9  HSMH-C170  [SMD _LED]
R12  100R  [CC2012-0805]
R13  120R  [CC2012-0805]
R14  100R  [CC2012-0805]
R15  270R  [CR2012-0805]
R17  47R  [CC2012-0805]
R18  120R  [CC2012-0805]
R19  5R6  [CC2012-0805]
S1  TL36WW050  [PCB_SWITCH]
TP1  (5V)  [TP]  (no BOM)
TP2  (3V3)  [TP]  (no BOM)
TP3  (1V8)  [TP]  (no BOM)
U3  LM1084IS-ADJ  [TO-263]
U4  LM1084IS-ADJ  [TO-263]

### Nets
5V: C1.1 C13.1 C27.1 R15.2 S1.1 S1.2 TP1.1 U3.3(IN) U4.3(IN)
GND: C1.2 C2.2 C3.2 C5.1 C6.2 C7.2 C8.2 C9.2 C10.2 C11.2 C12.2 C13.2 C14.2 C17.1 C18.1 C20.2 C21.2 C22.1 C23.2 C24.1 C25.2 C26.2 C27.2 C28.2 C29.2 C30.2 C31.2 C32.2 C33.2 C34.1 C35.2 C36.1 C37.2 C38.2 C39.2 C40.2 C41.2 C42.2 C43.2 D1.1(A) J1.2 J1.3 JP2.1 JP2.2 JP6.1 JP6.2 LED9.2(K) R14.1 R19.2
VCCINT: C3.1 C7.1 C8.1 C10.1 C20.1 C21.1 C25.1 C26.1 C28.1 C29.1 C30.1 C32.1 C34.2 C38.1 C39.1 C41.1 R18.1 TP3.1 U4.2(OUT)  [also labelled 1V8]
VCCO: C2.1 C5.2 C6.1 C9.1 C11.1 C12.1 C14.1 C17.2 C18.2 C22.2 C23.1 C24.2 C31.1 C33.1 C35.1 C36.2 C37.1 C40.1 C42.1 C43.1 R13.1 TP2.1 U3.2(OUT)  [also labelled 3V3]
PWR_IN: F1.1 J1.1
NetD1_2: D1.2(K) F1.2 S1.3
NetLED9_1: LED9.1(A) R15.1
NetR12_1: R12.1 R13.2 U3.1
NetR12_2: R12.2 R14.2
NetR17_1: R17.1 R18.2 U4.1
NetR17_2: R17.2 R19.1

### Notes on the sheet
- 3V3
- 1V8 Decoupling
- 3V3 Decoupling
- Title
- Size:
- Date:
- B
- Number:
- Time:
- Revision:
- Sheet
- of
- File:

### Library data of the parts
C1-C3 = CAP_POLAR_1: Polar Capacitor
C5-C12 C17 C18 C20-C22 C24-C26 C31 C32 C34-C43 = CAP: Capacitor; Supplier: FARNELL; Supplier Code: 317-287
C13 C14 C23 C27-C30 C33 = CAP_POLAR: Polar Capacitor; AEMS Code: 2100110; Supplier: FARNELL; Supplier Code: 967-117
D1 = BZG03C13: Zener Diode, 6.2V, 5W; Manufacturer: Microsemi; Revision: 31-Oct-2003
F1 = Fuse 2: Polyswitch 1.1A, Raychem RUE110; Revision: July-2002: Re-released for DXP Platform.; Supplier: FARNELL; Supplier Code: 608-907
J1 = KLD-0202-B: Low Voltage Power Supply Connector; Manufacturer: Kycon; AEMS Code: 3510211
JP2 JP6 = Jumper, 2-Pin
JS1 = Jumper Socket: Shorting Link, 2.54mm (0.1") Pitch
LED9 = HSMX-C670: as LED8 on sheet SL_Config_2E; Revision: July-2002: Re-released for DXP Platform.
R12 R14 = RES: Resistor; AEMS Code: 1200012JT
R13 R18 = RES: Resistor; AEMS Code: 1200781
R15 = RES: Resistor; AEMS Code: 1200430
R17 = RES: Resistor; AEMS Code: CHANGED VALUE
R19 = RES: Resistor; AEMS Code: 1200069
S1 = PCB_MOUNT_SWITCH: SPDT Subminiature Toggle Switch; Supplier: FARNELL; Supplier Code: 150-559
TP1-TP3 = TestPin
U3 U4 = LM1084IS-ADJ: 5A Low Dropout Possitive Regulators

## Nets that join several sheets
5V: SL_LCD_SW_LED_2E (15 pins), SL_Power (9 pins)
GND: SL1 Xilinx Spartan-IIE PQ208 Rev1.01 (12 pins), SL_Config_2E (C4.2 C44.1 U5.11 U6.3), SL_LCD_SW_LED_2E (22 pins), SL_FPGA_Auto_2E (28 pins), SL_Power (49 pins)
VCCINT: SL_FPGA_Auto_2E (12 pins), SL_Power (19 pins)
VCCO: SL1 Xilinx Spartan-IIE PQ208 Rev1.01 (5 pins), SL_Config_2E (10 pins), SL_LCD_SW_LED_2E (9 pins), SL_FPGA_Auto_2E (16 pins), SL_Power (23 pins)
CCLK: SL_Config_2E (U5.3), SL_FPGA_Auto_2E (U1.155)
CLK_BRD: SL1 Xilinx Spartan-IIE PQ208 Rev1.01 (NT1.2 Y1.3), SL_FPGA_Auto_2E (U1.80)
CLK_BRD_1: SL1 Xilinx Spartan-IIE PQ208 Rev1.01 (NT1.1), SL_FPGA_Auto_2E (U1.77)
DIN: SL_Config_2E (U5.1), SL_FPGA_Auto_2E (U1.153)
DONE: SL_Config_2E (R4.2 U5.10 U6.2), SL_FPGA_Auto_2E (U1.104)
HA2: SL1 Xilinx Spartan-IIE PQ208 Rev1.01 (HDR2.2), SL_FPGA_Auto_2E (U1.191)
HA3: SL1 Xilinx Spartan-IIE PQ208 Rev1.01 (HDR2.3 JP3.2), SL_FPGA_Auto_2E (U1.189)
HA4: SL1 Xilinx Spartan-IIE PQ208 Rev1.01 (HDR2.4), SL_FPGA_Auto_2E (U1.188)
HA5: SL1 Xilinx Spartan-IIE PQ208 Rev1.01 (HDR2.5 JP4.2), SL_FPGA_Auto_2E (U1.187)
HA6: SL1 Xilinx Spartan-IIE PQ208 Rev1.01 (HDR2.6), SL_FPGA_Auto_2E (U1.181)
HA7: SL1 Xilinx Spartan-IIE PQ208 Rev1.01 (HDR2.7), SL_FPGA_Auto_2E (U1.179)
HA8: SL1 Xilinx Spartan-IIE PQ208 Rev1.01 (HDR2.8), SL_FPGA_Auto_2E (U1.180)
HA9: SL1 Xilinx Spartan-IIE PQ208 Rev1.01 (HDR2.9), SL_FPGA_Auto_2E (U1.176)
HA10: SL1 Xilinx Spartan-IIE PQ208 Rev1.01 (HDR2.10), SL_FPGA_Auto_2E (U1.178)
HA11: SL1 Xilinx Spartan-IIE PQ208 Rev1.01 (HDR2.11), SL_FPGA_Auto_2E (U1.174)
HA12: SL1 Xilinx Spartan-IIE PQ208 Rev1.01 (HDR2.12), SL_FPGA_Auto_2E (U1.175)
HA13: SL1 Xilinx Spartan-IIE PQ208 Rev1.01 (HDR2.13), SL_FPGA_Auto_2E (U1.169)
HA14: SL1 Xilinx Spartan-IIE PQ208 Rev1.01 (HDR2.14), SL_FPGA_Auto_2E (U1.173)
HA15: SL1 Xilinx Spartan-IIE PQ208 Rev1.01 (HDR2.15), SL_FPGA_Auto_2E (U1.167)
HA16: SL1 Xilinx Spartan-IIE PQ208 Rev1.01 (HDR2.16), SL_FPGA_Auto_2E (U1.168)
HA17: SL1 Xilinx Spartan-IIE PQ208 Rev1.01 (HDR2.17), SL_FPGA_Auto_2E (U1.165)
HA18: SL1 Xilinx Spartan-IIE PQ208 Rev1.01 (HDR2.18), SL_FPGA_Auto_2E (U1.166)
HA19: SL1 Xilinx Spartan-IIE PQ208 Rev1.01 (HDR2.19), SL_FPGA_Auto_2E (U1.164)
HARD_TCK: SL1 Xilinx Spartan-IIE PQ208 Rev1.01 (HDR1.3), SL_Config_2E (U5.6), SL_FPGA_Auto_2E (U1.207)
HARD_TDI: SL1 Xilinx Spartan-IIE PQ208 Rev1.01 (HDR1.1), SL_FPGA_Auto_2E (U1.159)
HARD_TDO: SL1 Xilinx Spartan-IIE PQ208 Rev1.01 (HDR1.2), SL_Config_2E (U5.17)
HARD_TMS: SL1 Xilinx Spartan-IIE PQ208 Rev1.01 (HDR1.4), SL_Config_2E (U5.5), SL_FPGA_Auto_2E (U1.2)
HB2: SL1 Xilinx Spartan-IIE PQ208 Rev1.01 (HDR3.2), SL_FPGA_Auto_2E (U1.163)
HB3: SL1 Xilinx Spartan-IIE PQ208 Rev1.01 (HDR3.3), SL_FPGA_Auto_2E (U1.160)
HB4: SL1 Xilinx Spartan-IIE PQ208 Rev1.01 (HDR3.4), SL_FPGA_Auto_2E (U1.162)
HB5: SL1 Xilinx Spartan-IIE PQ208 Rev1.01 (HDR3.5), SL_FPGA_Auto_2E (U1.138)
HB6: SL1 Xilinx Spartan-IIE PQ208 Rev1.01 (HDR3.6), SL_FPGA_Auto_2E (U1.161)
HB7: SL1 Xilinx Spartan-IIE PQ208 Rev1.01 (HDR3.7), SL_FPGA_Auto_2E (U1.135)
HB8: SL1 Xilinx Spartan-IIE PQ208 Rev1.01 (HDR3.8), SL_FPGA_Auto_2E (U1.136)
HB9: SL1 Xilinx Spartan-IIE PQ208 Rev1.01 (HDR3.9), SL_FPGA_Auto_2E (U1.133)
HB10: SL1 Xilinx Spartan-IIE PQ208 Rev1.01 (HDR3.10), SL_FPGA_Auto_2E (U1.134)
HB11: SL1 Xilinx Spartan-IIE PQ208 Rev1.01 (HDR3.11), SL_FPGA_Auto_2E (U1.129)
HB12: SL1 Xilinx Spartan-IIE PQ208 Rev1.01 (HDR3.12), SL_FPGA_Auto_2E (U1.132)
HB13: SL1 Xilinx Spartan-IIE PQ208 Rev1.01 (HDR3.13), SL_FPGA_Auto_2E (U1.126)
HB14: SL1 Xilinx Spartan-IIE PQ208 Rev1.01 (HDR3.14), SL_FPGA_Auto_2E (U1.127)
HB15: SL1 Xilinx Spartan-IIE PQ208 Rev1.01 (HDR3.15), SL_FPGA_Auto_2E (U1.123)
HB16: SL1 Xilinx Spartan-IIE PQ208 Rev1.01 (HDR3.16), SL_FPGA_Auto_2E (U1.125)
HB17: SL1 Xilinx Spartan-IIE PQ208 Rev1.01 (HDR3.17), SL_FPGA_Auto_2E (U1.121)
HB18: SL1 Xilinx Spartan-IIE PQ208 Rev1.01 (HDR3.18), SL_FPGA_Auto_2E (U1.122)
HB19: SL1 Xilinx Spartan-IIE PQ208 Rev1.01 (HDR3.19), SL_FPGA_Auto_2E (U1.120)
~{INIT}: SL_Config_2E (R5.2 U5.8), SL_FPGA_Auto_2E (U1.107)
JTAG_NEXUS_TCK: SL1 Xilinx Spartan-IIE PQ208 Rev1.01 (HDR1.7), SL_FPGA_Auto_2E (U1.6)
JTAG_NEXUS_TDI: SL1 Xilinx Spartan-IIE PQ208 Rev1.01 (HDR1.5), SL_FPGA_Auto_2E (U1.4)
JTAG_NEXUS_TDO: SL1 Xilinx Spartan-IIE PQ208 Rev1.01 (HDR1.6), SL_FPGA_Auto_2E (U1.5)
JTAG_NEXUS_TMS: SL1 Xilinx Spartan-IIE PQ208 Rev1.01 (HDR1.8), SL_FPGA_Auto_2E (U1.7)
LCD_DB0: SL_LCD_SW_LED_2E (RA2.5), SL_FPGA_Auto_2E (U1.20)
LCD_DB1: SL_LCD_SW_LED_2E (RA2.6), SL_FPGA_Auto_2E (U1.18)
LCD_DB2: SL_LCD_SW_LED_2E (RA2.7), SL_FPGA_Auto_2E (U1.17)
LCD_DB3: SL_LCD_SW_LED_2E (RA2.8), SL_FPGA_Auto_2E (U1.16)
LCD_DB4: SL_LCD_SW_LED_2E (RA3.5), SL_FPGA_Auto_2E (U1.15)
LCD_DB5: SL_LCD_SW_LED_2E (RA3.6), SL_FPGA_Auto_2E (U1.11)
LCD_DB6: SL_LCD_SW_LED_2E (RA3.7), SL_FPGA_Auto_2E (U1.10)
LCD_DB7: SL_LCD_SW_LED_2E (RA3.8), SL_FPGA_Auto_2E (U1.9)
LCD_E: SL_LCD_SW_LED_2E (RA1.8), SL_FPGA_Auto_2E (U1.21)
LCD_LIGHT: SL_LCD_SW_LED_2E (R2.1), SL_FPGA_Auto_2E (U1.8)
LCD_RS: SL_LCD_SW_LED_2E (RA1.6), SL_FPGA_Auto_2E (U1.23)
LCD_RW: SL_LCD_SW_LED_2E (RA1.7), SL_FPGA_Auto_2E (U1.22)
LEDS0: SL_LCD_SW_LED_2E (LED0.1), SL_FPGA_Auto_2E (U1.102)
LEDS1: SL_LCD_SW_LED_2E (LED1.1), SL_FPGA_Auto_2E (U1.101)
LEDS2: SL_LCD_SW_LED_2E (LED2.1), SL_FPGA_Auto_2E (U1.100)
LEDS3: SL_LCD_SW_LED_2E (LED3.1), SL_FPGA_Auto_2E (U1.99)
LEDS4: SL_LCD_SW_LED_2E (LED4.1), SL_FPGA_Auto_2E (U1.98)
LEDS5: SL_LCD_SW_LED_2E (LED5.1), SL_FPGA_Auto_2E (U1.97)
LEDS6: SL_LCD_SW_LED_2E (LED6.1), SL_FPGA_Auto_2E (U1.96)
LEDS7: SL_LCD_SW_LED_2E (LED7.1), SL_FPGA_Auto_2E (U1.95)
M0: SL1 Xilinx Spartan-IIE PQ208 Rev1.01 (JP5.1 R7.2), SL_FPGA_Auto_2E (U1.52)
PROG_B: SL_Config_2E (R6.2 U5.7), SL_FPGA_Auto_2E (U1.106)
SW0: SL_LCD_SW_LED_2E (RA7.1 S2.16), SL_FPGA_Auto_2E (U1.108)
SW1: SL_LCD_SW_LED_2E (RA7.2 S2.15), SL_FPGA_Auto_2E (U1.109)
SW2: SL_LCD_SW_LED_2E (RA7.3 S2.14), SL_FPGA_Auto_2E (U1.110)
SW3: SL_LCD_SW_LED_2E (RA7.4 S2.13), SL_FPGA_Auto_2E (U1.111)
SW4: SL_LCD_SW_LED_2E (RA8.1 S2.12), SL_FPGA_Auto_2E (U1.112)
SW5: SL_LCD_SW_LED_2E (RA8.2 S2.11), SL_FPGA_Auto_2E (U1.113)
SW6: SL_LCD_SW_LED_2E (RA8.3 S2.10), SL_FPGA_Auto_2E (U1.114)
SW7: SL_LCD_SW_LED_2E (RA8.4 S2.9), SL_FPGA_Auto_2E (U1.115)
TDI_C: SL_Config_2E (U5.4), SL_FPGA_Auto_2E (U1.157)
TEST: SL_LCD_SW_LED_2E (R16.2 S3.1 S3.2), SL_FPGA_Auto_2E (U1.27)
Xout_Alt: SL1 Xilinx Spartan-IIE PQ208 Rev1.01 (JP3.1 R22.1), SL_FPGA_Auto_2E (U1.30)
Yout_Alt: SL1 Xilinx Spartan-IIE PQ208 Rev1.01 (JP4.1 R21.1), SL_FPGA_Auto_2E (U1.31)